# Altium schematic sheet Sheet1.SchDoc (part 3 of 4)
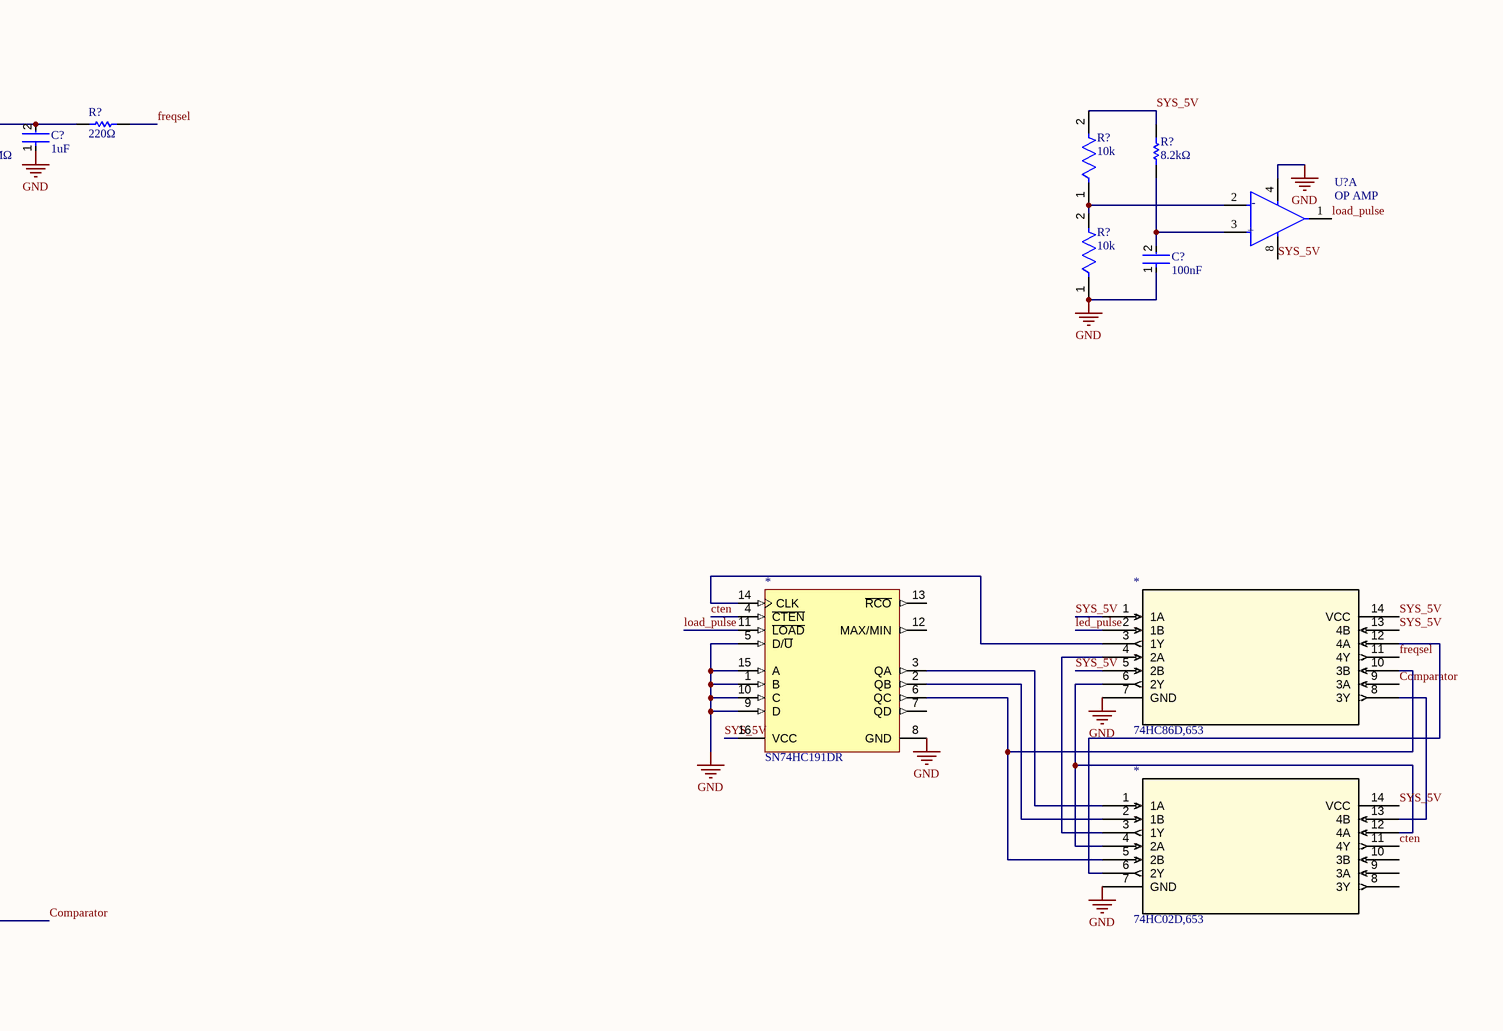
[diagram p3: Sheet1.SchDoc, right]

## Library data of the parts (continued)
C?#10 = CC0805CRNPO9BN5R0: CAP CER 5pF 50V NP0 0805; Manufacturer: Yageo Group; Dielectric: C0G; Dielectric Material: Ceramic; Supplier: Future Electronics; Supplier Part Number: CC0805CRNPO9BN5R0; Manufacturer Part Number: CC0805CRNPO9BN5R0; RoHS: Compliant; Category: Ceramic Capacitors; Stock: 16000; Pricing: 4000=0.0639, 8000=0.0628, 12000=0.0622, 16000=0.0617, 20000=0.0604 (USD); Value: 5pF; Case/Package: 0805; Case Code (Imperial): 0805; Case Code (Metric): 2012; China RoHS: Compliant; Composition: Ceramic; Depth: 1.25mm; Halogen Free: Halogen Free; Lead Free: Lead Free; Length: 2mm; Lifecycle Status: Production; Max Operating Temperature: 125°C; Min Operating Temperature: -55°C; Mounting Technology: Surface Mount; Number of Terminals: 2; Packaging: Tape and Reel; Radiation Hardening: No; REACH SVHC: Unaffected; Termination: SMD/SMT; Thickness: 711.2µm; Voltage Rating: 50V; Voltage Rating (DC): 50V; Weight: 5.499807mg; Width: 1.2446mm; ComponentLink1URL: https://datasheet.octopart.com:443/CC0805CRNPO9BN5R0-Yageo-datasheet-137875056.pdf?src-supplier=IHS; ComponentLink1Description: https://datasheet.octopart.com:443/CC0805CRNPO9BN5R0-Yageo-datasheet-137875056.pdf?src-supplier=IHS; ComponentLink2URL: https://datasheet.octopart.com:443/CC0805CRNPO9BN5R0-Yageo-Group-datasheet-192360829.pdf?src-supplier=Future+Electronics; ComponentLink2Description: https://datasheet.octopart.com:443/CC0805CRNPO9BN5R0-Yageo-Group-datasheet-192360829.pdf?src-supplier=Future+Electronics; ComponentLink3URL: https://datasheet.octopart.com:443/CC0805CRNPO9BN5R0-Yageo-datasheet-137700082.pdf?src-supplier=Future+Electronics; ComponentLink3Description: https://datasheet.octopart.com:443/CC0805CRNPO9BN5R0-Yageo-datasheet-137700082.pdf?src-supplier=Future+Electronics; ComponentLink4URL: https://datasheet.octopart.com:443/CC0805CRNPO9BN5R0-Yageo-datasheet-78855684.pdf?src-supplier=Future+Electronics; ComponentLink4Description: https://datasheet.octopart.com:443/CC0805CRNPO9BN5R0-Yageo-datasheet-78855684.pdf?src-supplier=Future+Electronics; ComponentLink5URL: https://datasheet.octopart.com:443/CC0805CRNPO9BN5R0-Yageo-datasheet-24578986.pdf?src-supplier=Future+Electronics; ComponentLink5Description: https://datasheet.octopart.com:443/CC0805CRNPO9BN5R0-Yageo-datasheet-24578986.pdf?src-supplier=Future+Electronics; ComponentLink6URL: https://datasheet.octopart.com:443/CC0805CRNPO9BN5R0-Yageo-datasheet-16730043.pdf?src-supplier=Future+Electronics; ComponentLink6Description: https://datasheet.octopart.com:443/CC0805CRNPO9BN5R0-Yageo-datasheet-16730043.pdf?src-supplier=Future+Electronics; ComponentLink7URL: https://datasheet.octopart.com:443/CC0805CRNPO9BN5R0-Yageo-datasheet-12589826.pdf?src-supplier=Future+Electronics; ComponentLink7Description: https://datasheet.octopart.com:443/CC0805CRNPO9BN5R0-Yageo-datasheet-12589826.pdf?src-supplier=Future+Electronics; ComponentLink8URL: https://datasheet.octopart.com:443/CC0805CRNPO9BN5R0-Yageo-datasheet-182878260.pdf?src-supplier=Farnell; ComponentLink8Description: https://datasheet.octopart.com:443/CC0805CRNPO9BN5R0-Yageo-datasheet-182878260.pdf?src-supplier=Farnell; ComponentLink9URL: https://datasheet.octopart.com:443/CC0805CRNPO9BN5R0-Yageo-datasheet-151948684.pdf?src-supplier=Newark; ComponentLink9Description: https://datasheet.octopart.com:443/CC0805CRNPO9BN5R0-Yageo-datasheet-151948684.pdf?src-supplier=Newark; ComponentLink10URL: https://datasheet.octopart.com:443/CC0805CRNPO9BN5R0-Yageo-datasheet-10406438.pdf?src-supplier=_legacy+Avnet; ComponentLink10Description: https://datasheet.octopart.com:443/CC0805CRNPO9BN5R0-Yageo-datasheet-10406438.pdf?src-supplier=_legacy+Avnet; ComponentLink11URL: http://sigma.octopart.com:80/conflict_mineral_statement/Yageo-company-3.pdf?src-supplier=Compliance+Statements; ComponentLink11Description: http://sigma.octopart.com:80/conflict_mineral_statement/Yageo-company-3.pdf?src-supplier=Compliance+Statements; ComponentLink12URL: http://sigma.octopart.com:80/rohs_statement/Yageo-company-2.pdf?src-supplier=Compliance+Statements; ComponentLink12Description: http://sigma.octopart.com:80/rohs_statement/Yageo-company-2.pdf?src-supplier=Compliance+Statements
C?#14 = CL21B102KBCNNNC: CAP CER 1nF 50V X7R 0805; Manufacturer: Samsung Electro-Mechanics; Dielectric Material: Ceramic; Tolerance: 10%; Supplier: Avnet; Supplier Part Number: CL21B102KBCNNNC; Manufacturer Part Number: CL21B102KBCNNNC; RoHS: Compliant; Category: Ceramic Capacitors; Stock: 428000; Pricing: 4000=0.0102 (USD); Value: 1nF; Case/Package: 0805; Case Code (Imperial): 0805; Case Code (Metric): 2012; China RoHS: Compliant; Country of Origin: Mainland China, Philippines, South Korea; Depth: 1.25mm; Dielectric: X7R; Export Control Classification Number (ECCN) Code: EAR99; Height: 850µm; Harmonized Tariff Schedule (HTS) Code: 8532.24.00.20; Introduction Date: 2010-07-30; Lead Free: Lead Free; Length: 2mm; Lifecycle Status: Production; Material: Ceramic; Max Operating Temperature: 125°C; Min Operating Temperature: -55°C; Mounting Technology: Surface Mount; Number of Terminals: 2; Radiation Hardening: No; REACH SVHC: Unaffected; Schedule B: 8532240020, 8532240020|8532240020|8532240020|8532240020|8532240020|8532240020|8532240020|8532240020|8532240020|8532240020|8532240020|8532240020|8532240020|8532240020|8532240020|8532240020|8532240020|8532240020|8532240020|8532240020|8532240020|8532240020|8532240020|85; Thickness: 939.8µm; Voltage Rating: 50V; Voltage Rating (DC): 50V; Width: 1.25mm; ComponentLink1URL: https://datasheet.octopart.com:443/CL21B102KBCNNNC-Samsung-Electro-Mechanics-datasheet-136482475.pdf?src-supplier=IHS; ComponentLink1Description: https://datasheet.octopart.com:443/CL21B102KBCNNNC-Samsung-Electro-Mechanics-datasheet-136482475.pdf?src-supplier=IHS; ComponentLink2URL: https://datasheet.octopart.com:443/CL21B102KBCNNNC-Samsung-Electro-Mechanics-datasheet-116891019.pdf?src-supplier=Future+Electronics; ComponentLink2Description: https://datasheet.octopart.com:443/CL21B102KBCNNNC-Samsung-Electro-Mechanics-datasheet-116891019.pdf?src-supplier=Future+Electronics; ComponentLink3URL: https://datasheet.octopart.com:443/CL21B102KBCNNNC-Samsung-Electro-Mechanics-datasheet-81462161.pdf?src-supplier=Future+Electronics; ComponentLink3Description: https://datasheet.octopart.com:443/CL21B102KBCNNNC-Samsung-Electro-Mechanics-datasheet-81462161.pdf?src-supplier=Future+Electronics; ComponentLink4URL: https://datasheet.octopart.com:443/CL21B102KBCNNNC-Samsung-datasheet-31820677.pdf?src-supplier=Future+Electronics; ComponentLink4Description: https://datasheet.octopart.com:443/CL21B102KBCNNNC-Samsung-datasheet-31820677.pdf?src-supplier=Future+Electronics; ComponentLink5URL: https://datasheet.octopart.com:443/CL21B102KBCNNNC-Samsung-Electro-Mechanics-datasheet-149045903.pdf?src-supplier=Future+Electronics; ComponentLink5Description: https://datasheet.octopart.com:443/CL21B102KBCNNNC-Samsung-Electro-Mechanics-datasheet-149045903.pdf?src-supplier=Future+Electronics; ComponentLink6URL: https://datasheet.octopart.com:443/CL21B102KBCNNNC-Samsung-datasheet-37081328.pdf?src-supplier=Future+Electronics; ComponentLink6Description: https://datasheet.octopart.com:443/CL21B102KBCNNNC-Samsung-datasheet-37081328.pdf?src-supplier=Future+Electronics; ComponentLink7URL: https://datasheet.octopart.com/CL21B102KBCNNNC-Samsung-Electro-Mechanics-datasheet-97040617.pdf; ComponentLink7Description: https://datasheet.octopart.com/CL21B102KBCNNNC-Samsung-Electro-Mechanics-datasheet-97040617.pdf; ComponentLink8URL: https://datasheet.octopart.com/CL21B102KBCNNNC-Samsung-Electro-Mechanics-datasheet-8324245.pdf; ComponentLink8Description: https://datasheet.octopart.com/CL21B102KBCNNNC-Samsung-Electro-Mechanics-datasheet-8324245.pdf; ComponentLink9URL: https://datasheet.octopart.com/General-Multilayer-Ceramic-Capacitors-Samsung-datasheet-family-111.pdf; ComponentLink9Description: https://datasheet.octopart.com/General-Multilayer-Ceramic-Capacitors-Samsung-datasheet-family-111.pdf; ComponentLink10URL: http://sigma.octopart.com:80/rohs_certificate/General-Multilayer-Ceramic-Capacitors-Samsung-family-110.pdf?src-supplier=Compliance+Statements; ComponentLink10Description: http://sigma.octopart.com:80/rohs_certificate/General-Multilayer-Ceramic-Capacitors-Samsung-family-110.pdf?src-supplier=Compliance+Statements; ComponentLink11URL: http://sigma.octopart.com:80/rohs_statement/General-Multilayer-Ceramic-Capacitors-Samsung-family-132.pdf?src-supplier=Compliance+Statements; ComponentLink11Description: http://sigma.octopart.com:80/rohs_statement/General-Multilayer-Ceramic-Capacitors-Samsung-family-132.pdf?src-supplier=Compliance+Statements; ComponentLink12URL: http://sigma.octopart.com:80/reach_statement/General-Multilayer-Ceramic-Capacitors-Samsung-family-133.pdf?src-supplier=Compliance+Statements; ComponentLink12Description: http://sigma.octopart.com:80/reach_statement/General-Multilayer-Ceramic-Capacitors-Samsung-family-133.pdf?src-supplier=Compliance+Statements
C?#15 = CC0805JRNPO9BN100: CAP CER 10pF 50V NP0 0805; Manufacturer: Yageo Group; Manufacturer Package Identifier: 0805 (2012 metric); Dielectric: C0G; Dielectric Material: Ceramic; Temperature Coefficient: 30ppm/°C; Tolerance: 5%; Supplier: Future Electronics; Supplier Part Number: CC0805JRNPO9BN100; Manufacturer Part Number: CC0805JRNPO9BN100; RoHS: Compliant; Category: Ceramic Capacitors; Stock: 244000; Pricing: 4000=0.0962, 8000=0.0945, 12000=0.0936, 16000=0.0929, 20000=0.0908 (USD); Value: 10pF; Case/Package: 0805; Case Code (Imperial): 0805; Case Code (Metric): 2012; China RoHS: Compliant; Composition: Ceramic; Country of Origin: Mainland China, Taiwan; Depth: 1.25mm; Export Control Classification Number (ECCN) Code: EAR99; Halogen Free: Halogen Free; Height: 600µm; Harmonized Tariff Schedule (HTS) Code: 8532.24.00.20; Introduction Date: 2005-07-07; Lead Free: Lead Free; Length: 2mm; Lifecycle Status: Production; Material: Ceramic; Max Operating Temperature: 125°C; Min Operating Temperature: -55°C; Mounting Technology: Surface Mount; Pins: 2; Number of Terminals: 2; Packaging: Digi-Reel®; Radiation Hardening: No; REACH SVHC: Unaffected; Schedule B: 8532240020, 8532240020|8532240020, 8532240020|8532240020|8532240020, 8532240020|8532240020|8532240020|8532240020; Termination: SMD/SMT; Thickness: 609.6µm; Voltage Rating: 50V; Voltage Rating (DC): 50V; Width: 1.25mm; ComponentLink1URL: https://datasheet.octopart.com:443/CC0805JRNPO9BN100-Yageo-datasheet-182140217.pdf?src-supplier=IHS; ComponentLink1Description: https://datasheet.octopart.com:443/CC0805JRNPO9BN100-Yageo-datasheet-182140217.pdf?src-supplier=IHS; ComponentLink2URL: https://datasheet.octopart.com:443/CC0805JRNPO9BN100-Yageo-datasheet-151948684.pdf?src-supplier=Farnell; ComponentLink2Description: https://datasheet.octopart.com:443/CC0805JRNPO9BN100-Yageo-datasheet-151948684.pdf?src-supplier=Farnell; ComponentLink3URL: https://datasheet.octopart.com:443/CC0805JRNPO9BN100-Yageo-datasheet-137875056.pdf?src-supplier=Future+Electronics; ComponentLink3Description: https://datasheet.octopart.com:443/CC0805JRNPO9BN100-Yageo-datasheet-137875056.pdf?src-supplier=Future+Electronics; ComponentLink4URL: https://datasheet.octopart.com:443/CC0805JRNPO9BN100-Yageo-datasheet-136957424.pdf?src-supplier=Future+Electronics; ComponentLink4Description: https://datasheet.octopart.com:443/CC0805JRNPO9BN100-Yageo-datasheet-136957424.pdf?src-supplier=Future+Electronics; ComponentLink5URL: https://datasheet.octopart.com:443/CC0805JRNPO9BN100-Yageo-datasheet-137700082.pdf?src-supplier=Future+Electronics; ComponentLink5Description: https://datasheet.octopart.com:443/CC0805JRNPO9BN100-Yageo-datasheet-137700082.pdf?src-supplier=Future+Electronics; ComponentLink6URL: https://datasheet.octopart.com:443/CC0805JRNPO9BN100-Yageo-datasheet-78855684.pdf?src-supplier=Future+Electronics; ComponentLink6Description: https://datasheet.octopart.com:443/CC0805JRNPO9BN100-Yageo-datasheet-78855684.pdf?src-supplier=Future+Electronics; ComponentLink7URL: https://datasheet.octopart.com:443/CC0805JRNPO9BN100-Yageo-datasheet-16730043.pdf?src-supplier=Future+Electronics; ComponentLink7Description: https://datasheet.octopart.com:443/CC0805JRNPO9BN100-Yageo-datasheet-16730043.pdf?src-supplier=Future+Electronics; ComponentLink8URL: https://datasheet.octopart.com:443/CC0805JRNPO9BN100-Yageo-datasheet-12589826.pdf?src-supplier=Future+Electronics; ComponentLink8Description: https://datasheet.octopart.com:443/CC0805JRNPO9BN100-Yageo-datasheet-12589826.pdf?src-supplier=Future+Electronics; ComponentLink9URL: https://datasheet.octopart.com:443/CC0805JRNPO9BN100-Yageo-datasheet-8817079.pdf?src-supplier=Future+Electronics; ComponentLink9Description: https://datasheet.octopart.com:443/CC0805JRNPO9BN100-Yageo-datasheet-8817079.pdf?src-supplier=Future+Electronics; ComponentLink10URL: https://datasheet.octopart.com:443/CC0805JRNPO9BN100-Yageo-datasheet-8324240.pdf?src-supplier=Future+Electronics; ComponentLink10Description: https://datasheet.octopart.com:443/CC0805JRNPO9BN100-Yageo-datasheet-8324240.pdf?src-supplier=Future+Electronics; ComponentLink11URL: https://datasheet.octopart.com:443/CC0805JRNPO9BN100-Yageo-datasheet-504625.pdf?src-supplier=Future+Electronics; ComponentLink11Description: https://datasheet.octopart.com:443/CC0805JRNPO9BN100-Yageo-datasheet-504625.pdf?src-supplier=Future+Electronics; ComponentLink12URL: https://datasheet.octopart.com:443/CC0805JRNPO9BN100-Yageo-datasheet-5321569.pdf?src-supplier=Future+Electronics; ComponentLink12Description: https://datasheet.octopart.com:443/CC0805JRNPO9BN100-Yageo-datasheet-5321569.pdf?src-supplier=Future+Electronics; ComponentLink13URL: https://datasheet.octopart.com:443/CC0805JRNPO9BN100-Yageo-datasheet-181969245.pdf?src-supplier=Newark; ComponentLink13Description: https://datasheet.octopart.com:443/CC0805JRNPO9BN100-Yageo-datasheet-181969245.pdf?src-supplier=Newark; ComponentLink14URL: https://datasheet.octopart.com:443/CC0805JRNPO9BN100-Yageo-datasheet-10406438.pdf?src-supplier=Newark; ComponentLink14Description: https://datasheet.octopart.com:443/CC0805JRNPO9BN100-Yageo-datasheet-10406438.pdf?src-supplier=Newark; ComponentLink15URL: https://datasheet.octopart.com:443/CC0805JRNPO9BN100-Yageo-datasheet-65873193.pdf?src-supplier=Newark; ComponentLink15Description: https://datasheet.octopart.com:443/CC0805JRNPO9BN100-Yageo-datasheet-65873193.pdf?src-supplier=Newark; ComponentLink16URL: https://datasheet.octopart.com:443/CC0805JRNPO9BN100-Yageo-Group-datasheet-188129580.pdf?src-supplier=LCSC; ComponentLink16Description: https://datasheet.octopart.com:443/CC0805JRNPO9BN100-Yageo-Group-datasheet-188129580.pdf?src-supplier=LCSC; ComponentLink17URL: https://datasheet.octopart.com:443/CC0805JRNPO9BN100-Yageo-datasheet-24578986.pdf?src-supplier=iodParts+Technologies+Inc.; ComponentLink17Description: https://datasheet.octopart.com:443/CC0805JRNPO9BN100-Yageo-datasheet-24578986.pdf?src-supplier=iodParts+Technologies+Inc.; ComponentLink18URL: https://datasheet.octopart.com:443/CC0805JRNPO9BN100-Yageo-datasheet-8555986.pdf?src-supplier=TME; ComponentLink18Description: https://datasheet.octopart.com:443/CC0805JRNPO9BN100-Yageo-datasheet-8555986.pdf?src-supplier=TME; ComponentLink19URL: http://sigma.octopart.com:80/conflict_mineral_statement/Yageo-company-3.pdf?src-supplier=Compliance+Statements; ComponentLink19Description: http://sigma.octopart.com:80/conflict_mineral_statement/Yageo-company-3.pdf?src-supplier=Compliance+Statements; ComponentLink20URL: http://sigma.octopart.com:80/rohs_statement/Yageo-company-2.pdf?src-supplier=Compliance+Statements; ComponentLink20Description: http://sigma.octopart.com:80/rohs_statement/Yageo-company-2.pdf?src-supplier=Compliance+Statements
D?#1-D?#4 = 1N4148WS: Diode Ultra Fast Recovery Rectifier 75V 0.15A 2-Pin SOD-323F T/R; Manufacturer: onsemi; Manufacturer Lifecycle Status: ACTIVE; Average Rectified Current: 150mA; Value: 4pF; Element Configuration: Single; Forward Voltage: 1V; Max Forward Surge Current (Ifsm): 4A; Max Junction Temperature (Tj): 150°C; Max Power Dissipation: 200mW; Number of Elements: 1; Peak Reverse Current: 5µA; Recovery Time: 4ns; Supplier: Future Electronics; Supplier Part Number: 1N4148WS; Manufacturer Part Number: 1N4148WS; RoHS: Compliant; Category: Rectifier Diodes; Stock: 2079000; Pricing: 3000=0.0259, 9000=0.0253, 30000=0.0247, 60000=0.0243, 120000=0.0236 (USD); China RoHS: Compliant; Contact Plating: Tin; Export Control Classification Number (ECCN) Code: EAR99; Forward Current: 150mA; Height: 900µm; Harmonized Tariff Schedule (HTS) Code: 8541.10.00.70; Introduction Date: 2008-03-28; Lead Free: Lead Free; Length: 1.8mm; Lifecycle Status: Production; Max Operating Temperature: 150°C; Max Output current: 150mA; Max Repetitive Reverse Voltage (Vrrm): 75V; Max Reverse Voltage (DC): 75V; Min Breakdown Voltage: 75V; Min Operating Temperature: -55°C; Mounting Technology: Surface Mount; Pins: 2; Number of Terminals: 2; Packaging: Cut Tape; Power Dissipation: 200mW; Radiation Hardening: No; REACH SVHC: Unaffected; Reverse Recovery Time: 4ns; Reverse Standoff Voltage: 75V; Reverse Voltage: 75V; Schedule B: 8541100070, 8541100070|8541100070|8541100070|8541100070|8541100070|8541100070|8541100070|8541100070|8541100070|8541100070|8541100070|8541100070|8541100070|8541100070|8541100070|8541100070|8541100070|8541100070|8541100070|8541100070|8541100070|8541100070|8541100070|85; Weight: 27.6mg; Width: 1.35mm; ComponentLink1URL: https://datasheet.octopart.com:443/1N4148WS-ON-Semiconductor-datasheet-154551630.pdf?src-supplier=Farnell; ComponentLink1Description: https://datasheet.octopart.com:443/1N4148WS-ON-Semiconductor-datasheet-154551630.pdf?src-supplier=Farnell; ComponentLink2URL: https://datasheet.octopart.com:443/1N4148WS-Fairchild-Semiconductor-datasheet-67878664.pdf?src-supplier=Farnell; ComponentLink2Description: https://datasheet.octopart.com:443/1N4148WS-Fairchild-Semiconductor-datasheet-67878664.pdf?src-supplier=Farnell; ComponentLink3URL: https://datasheet.octopart.com:443/1N4148WS-Fairchild-Semiconductor-datasheet-68650011.pdf?src-supplier=Farnell; ComponentLink3Description: https://datasheet.octopart.com:443/1N4148WS-Fairchild-Semiconductor-datasheet-68650011.pdf?src-supplier=Farnell; ComponentLink4URL: https://datasheet.octopart.com:443/1N4148WS-ON-Semiconductor-datasheet-11741836.pdf?src-supplier=Upverter; ComponentLink4Description: https://datasheet.octopart.com:443/1N4148WS-ON-Semiconductor-datasheet-11741836.pdf?src-supplier=Upverter; ComponentLink5URL: https://datasheet.octopart.com:443/1N4148WS-ON-Semiconductor-datasheet-137236190.pdf?src-supplier=Upverter; ComponentLink5Description: https://datasheet.octopart.com:443/1N4148WS-ON-Semiconductor-datasheet-137236190.pdf?src-supplier=Upverter; ComponentLink6URL: https://sigma.octopart.com:443/138895951/technical_drawing/ON-Semiconductor-1N4148WS.pdf?src-supplier=Upverter; ComponentLink6Description: https://sigma.octopart.com:443/138895951/technical_drawing/ON-Semiconductor-1N4148WS.pdf?src-supplier=Upverter; ComponentLink7URL: https://datasheet.octopart.com:443/1N4148WS-ON-Semiconductor-datasheet-41168538.pdf?src-supplier=IHS; ComponentLink7Description: https://datasheet.octopart.com:443/1N4148WS-ON-Semiconductor-datasheet-41168538.pdf?src-supplier=IHS; ComponentLink8URL: https://datasheet.octopart.com:443/1N4148WS-onsemi-datasheet-175423434.pdf?src-supplier=IHS; ComponentLink8Description: https://datasheet.octopart.com:443/1N4148WS-onsemi-datasheet-175423434.pdf?src-supplier=IHS; ComponentLink9URL: https://datasheet.octopart.com:443/1N4148WS-onsemi-datasheet-181265883.pdf?src-supplier=IHS; ComponentLink9Description: https://datasheet.octopart.com:443/1N4148WS-onsemi-datasheet-181265883.pdf?src-supplier=IHS; ComponentLink10URL: https://datasheet.octopart.com:443/1N4148WS-ON-Semiconductor-datasheet-85393213.pdf?src-supplier=onsemi; ComponentLink10Description: https://datasheet.octopart.com:443/1N4148WS-ON-Semiconductor-datasheet-85393213.pdf?src-supplier=onsemi; ComponentLink11URL: https://datasheet.octopart.com:443/1N4148WS-ON-Semiconductor-datasheet-86684483.pdf?src-supplier=onsemi; ComponentLink11Description: https://datasheet.octopart.com:443/1N4148WS-ON-Semiconductor-datasheet-86684483.pdf?src-supplier=onsemi; ComponentLink12URL: https://datasheet.octopart.com:443/1N4148WS-ON-Semiconductor-datasheet-86681927.pdf?src-supplier=element14+APAC; ComponentLink12Description: https://datasheet.octopart.com:443/1N4148WS-ON-Semiconductor-datasheet-86681927.pdf?src-supplier=element14+APAC; ComponentLink13URL: https://datasheet.octopart.com:443/1N4148WS-Fairchild-datasheet-514620.pdf?src-supplier=Fairchild+Semiconductor; ComponentLink13Description: https://datasheet.octopart.com:443/1N4148WS-Fairchild-datasheet-514620.pdf?src-supplier=Fairchild+Semiconductor; ComponentLink14URL: https://sigma.octopart.com:443/17343424/technical_drawing/Fairchild-Semiconductor-1N4148WS.pdf?src-supplier=Fairchild+Semiconductor; ComponentLink14Description: https://sigma.octopart.com:443/17343424/technical_drawing/Fairchild-Semiconductor-1N4148WS.pdf?src-supplier=Fairchild+Semiconductor; ComponentLink15URL: https://datasheet.octopart.com:443/1N4148WS-Fairchild-Semiconductor-datasheet-14041777.pdf?src-supplier=iiiC; ComponentLink15Description: https://datasheet.octopart.com:443/1N4148WS-Fairchild-Semiconductor-datasheet-14041777.pdf?src-supplier=iiiC; ComponentLink16URL: https://datasheet.octopart.com:443/1N4148WS-Fairchild-Semiconductor-datasheet-67909704.pdf?src-supplier=Newark; ComponentLink16Description: https://datasheet.octopart.com:443/1N4148WS-Fairchild-Semiconductor-datasheet-67909704.pdf?src-supplier=Newark; ComponentLink17URL: https://datasheet.octopart.com:443/1N4148WS-Fairchild-Semiconductor-datasheet-68364970.pdf?src-supplier=Newark; ComponentLink17Description: https://datasheet.octopart.com:443/1N4148WS-Fairchild-Semiconductor-datasheet-68364970.pdf?src-supplier=Newark; ComponentLink18URL: http://sigma.octopart.com:80/150599222/rohs_statement/ON-Semiconductor-1N4148WS.pdf?src-supplier=Compliance+Statements; ComponentLink18Description: http://sigma.octopart.com:80/150599222/rohs_statement/ON-Semiconductor-1N4148WS.pdf?src-supplier=Compliance+Statements; ComponentLink19URL: http://sigma.octopart.com:80/17343422/reach_statement/Fairchild-Semiconductor-1N4148WS.pdf?src-supplier=Compliance+Statements; ComponentLink19Description: http://sigma.octopart.com:80/17343422/reach_statement/Fairchild-Semiconductor-1N4148WS.pdf?src-supplier=Compliance+Statements; ComponentLink20URL: http://sigma.octopart.com:80/17343423/materials_sheet/Fairchild-Semiconductor-1N4148WS.pdf?src-supplier=Compliance+Statements; ComponentLink20Description: http://sigma.octopart.com:80/17343423/materials_sheet/Fairchild-Semiconductor-1N4148WS.pdf?src-supplier=Compliance+Statements; ComponentLink21URL: http://sigma.octopart.com:80/33026183/reach_statement/Fairchild-Semiconductor-1N4148WS.pdf?src-supplier=Compliance+Statements; ComponentLink21Description: http://sigma.octopart.com:80/33026183/reach_statement/Fairchild-Semiconductor-1N4148WS.pdf?src-supplier=Compliance+Statements; ComponentLink22URL: http://sigma.octopart.com:80/33026185/materials_sheet/Fairchild-Semiconductor-1N4148WS.pdf?src-supplier=Compliance+Statements; ComponentLink22Description: http://sigma.octopart.com:80/33026185/materials_sheet/Fairchild-Semiconductor-1N4148WS.pdf?src-supplier=Compliance+Statements; ComponentLink23URL: http://sigma.octopart.com:80/reach_statement/ON-Semiconductor-company-79.pdf?src-supplier=Compliance+Statements; ComponentLink23Description: http://sigma.octopart.com:80/reach_statement/ON-Semiconductor-company-79.pdf?src-supplier=Compliance+Statements; ComponentLink24URL: http://sigma.octopart.com:80/rohs_statement/Fairchild-Semiconductor-company-11.pdf?src-supplier=Compliance+Statements; ComponentLink24Description: http://sigma.octopart.com:80/rohs_statement/Fairchild-Semiconductor-company-11.pdf?src-supplier=Compliance+Statements; ComponentLink25URL: http://sigma.octopart.com:80/rohs_statement/Fairchild-Semiconductor-company-10.pdf?src-supplier=Compliance+Statements; ComponentLink25Description: http://sigma.octopart.com:80/rohs_statement/Fairchild-Semiconductor-company-10.pdf?src-supplier=Compliance+Statements; ComponentLink26URL: http://sigma.octopart.com:80/reach_statement/Fairchild-Semiconductor-company-9.pdf?src-supplier=Compliance+Statements; ComponentLink26Description: http://sigma.octopart.com:80/reach_statement/Fairchild-Semiconductor-company-9.pdf?src-supplier=Compliance+Statements; ComponentLink27URL: https://octopart.com:443/opatz8j6/c1?t=wYHt1dYoStjiSyYS9vW1pk8TBFbYWJPKFwAairMtkTI2IzetMnotf66dDCFSyjK73l_QBYJfu5ppQQm6vgf_VHJk0XjigTM6-T2M3bc91CoF2qDUavTaGra1FaS73nSZTMHoTBKea7Kj1j1hvcXpUjB2Zk0lMEeZ2KChoJjU2Ep7qPghMWyiv02ETchNH2mt-frVeZibxDJuov5OgRy4oXlMX2fxSj9TvPDNPennBmBqeUUTYkCA50MC-HqnwAKd1gKHUqYazBTe_nq1LN0s0W5Jcc0mVIJ85rMEaCpPi0OTe20L35dkFVsyd7-f2a8RbDuWQx2ZnqCVBv226imj86RP5GabsSkQ-q8&src-supplier=Compliance+Statements; ComponentLink27Description: https://octopart.com:443/opatz8j6/c1?t=wYHt1dYoStjiSyYS9vW1pk8TBFbYWJPKFwAairMtkTI2IzetMnotf66dDCFSyjK73l_QBYJfu5ppQQm6vgf_VHJk0XjigTM6-T2M3bc91CoF2qDUavTaGra1FaS73nSZTMHoTBKea7Kj1j1hvcXpUjB2Zk0lMEeZ2KChoJjU2Ep7qPghMWyiv02ETchNH2mt-frVeZibxDJuov5OgRy4oXlMX2fxSj9TvPDNPennBmBqeUUTYkCA50MC-HqnwAKd1gKHUqYazBTe_nq1LN0s0W5Jcc0mVIJ85rMEaCpPi0OTe20L35dkFVsyd7-f2a8RbDuWQx2ZnqCVBv226imj86RP5GabsSkQ-q8&src-supplier=Compliance+Statements; ComponentLink28URL: https://octopart.com:443/opatz8j6/c1?t=6vrIx-b4A-5fTDbLjwi5zcgi6qXstL13SMOS8GjYhuBtwDmRjNAy9ckQ1j_vzrk3p8PqJRRo0Q4ZFDRtNoBSdN2VF6uD6HFnto0wbTQpFwKFVCYeCRTsvot6NzZ0_E0kU2SFINObuRWijlVlxtaCxHPxDSHGUbvJMCGqPlgW3d4BMWXN1gHWf3JhMnqeX7DV1-lrPzrjwC1tz_ReOkIeYv0g5upleZgG8h_6jp4K0TmHBgFsbpIaQ-XR6Em3Oa61Yv4vos_yXn82U0YoobWb_whq6HKgdR1UB_qD5SusD-cTSj2uztk2uKh_PoqkpyxAx9Tc5grDAFkfViYluG8WwhfepkjrF-7yDpGH&src-supplier=Compliance+Statements; ComponentLink28Description: https://octopart.com:443/opatz8j6/c1?t=6vrIx-b4A-5fTDbLjwi5zcgi6qXstL13SMOS8GjYhuBtwDmRjNAy9ckQ1j_vzrk3p8PqJRRo0Q4ZFDRtNoBSdN2VF6uD6HFnto0wbTQpFwKFVCYeCRTsvot6NzZ0_E0kU2SFINObuRWijlVlxtaCxHPxDSHGUbvJMCGqPlgW3d4BMWXN1gHWf3JhMnqeX7DV1-lrPzrjwC1tz_ReOkIeYv0g5upleZgG8h_6jp4K0TmHBgFsbpIaQ-XR6Em3Oa61Yv4vos_yXn82U0YoobWb_whq6HKgdR1UB_qD5SusD-cTSj2uztk2uKh_PoqkpyxAx9Tc5grDAFkfViYluG8WwhfepkjrF-7yDpGH&src-supplier=Compliance+Statements
Q? = IRF4905STRLPBF: MOSFET P-CH 55V 42A D2PAK; Manufacturer: Infineon; Drain to Source Breakdown Voltage: -55V; Drain to Source Resistance: 20mΩ; Element Configuration: Single; Fall Time: 64ns; Gate to Source Voltage (Vgs): 20V; Input Capacitance: 3.5nF; Max Junction Temperature (Tj): 150°C; Max Power Dissipation: 170W; Nominal Vgs: 4V; Number of Channels: 1; Power Dissipation: 150W; Value: 20mΩ; Rise Time: 99ns; Turn-Off Delay Time: 51ns; Turn-On Delay Time: 20ns; Supplier: Future Electronics; Supplier Part Number: IRF4905STRLPBF; Manufacturer Part Number: IRF4905STRLPBF; RoHS: Compliant; Category: MOSFETs; Stock: 20800; Pricing: 800=2.4 (USD); Case/Package: D2PAK; China RoHS: Non-Compliant; Continuous Drain Current (ID): 42A; Country of Origin: Mainland China; Drain to Source Voltage (Vdss): -55V; Dual Supply Voltage: 55V; Export Control Classification Number (ECCN) Code: EAR99; Height: 5.084mm; Harmonized Tariff Schedule (HTS) Code: 8541.29.00.95; Introduction Date: 1996-07-26; Lead Free: Lead Free; Length: 10.67mm; Lifecycle Status: Production; Max Operating Temperature: 150°C; Min Breakdown Voltage: 55V; Min Operating Temperature: -55°C; Mounting Technology: Surface Mount; Number of Elements: 1; Pins: 3; Number of Terminals: 2; On-State Resistance: 20mΩ; Package Quantity: 800; Packaging: Cut Tape; Radiation Hardening: No; Rds On Max: 20mΩ; REACH SVHC: Affected; Schedule B: 8541290080, 8541290080|8541290080|8541290080|8541290080|8541290080|8541290080|8541290080|8541290080|8541290080|8541290080|8541290080|8541290080|8541290080|8541290080|8541290080|8541290080|8541290080|8541290080|8541290080|8541290080|8541290080|8541290080|8541290080|85; Termination: SMD/SMT; Threshold Voltage: 4V; Width: 9.65mm; ComponentLink1URL: https://datasheet.octopart.com:443/IRF4905STRLPBF-Infineon-datasheet-7823242.pdf?src-supplier=element14+APAC; ComponentLink1Description: https://datasheet.octopart.com:443/IRF4905STRLPBF-Infineon-datasheet-7823242.pdf?src-supplier=element14+APAC; ComponentLink2URL: https://datasheet.octopart.com:443/IRF4905STRLPBF-Infineon-datasheet-6397759.pdf?src-supplier=element14+APAC; ComponentLink2Description: https://datasheet.octopart.com:443/IRF4905STRLPBF-Infineon-datasheet-6397759.pdf?src-supplier=element14+APAC; ComponentLink3URL: https://datasheet.octopart.com:443/IRF4905STRLPBF-Infineon-datasheet-180067141.pdf?src-supplier=IHS; ComponentLink3Description: https://datasheet.octopart.com:443/IRF4905STRLPBF-Infineon-datasheet-180067141.pdf?src-supplier=IHS; ComponentLink4URL: https://datasheet.octopart.com:443/IRF4905STRLPBF-Infineon-datasheet-9781395.pdf?src-supplier=RS+(Formerly+Allied+Electronics); ComponentLink4Description: https://datasheet.octopart.com:443/IRF4905STRLPBF-Infineon-datasheet-9781395.pdf?src-supplier=RS+(Formerly+Allied+Electronics); ComponentLink5URL: https://datasheet.octopart.com:443/IRF4905STRLPBF-International-Rectifier-datasheet-8761984.pdf?src-supplier=Jameco+(USA); ComponentLink5Description: https://datasheet.octopart.com:443/IRF4905STRLPBF-International-Rectifier-datasheet-8761984.pdf?src-supplier=Jameco+(USA); ComponentLink6URL: https://datasheet.octopart.com:443/IRF4905STRLPBF-International-Rectifier-datasheet-14060552.pdf?src-supplier=iiiC; ComponentLink6Description: https://datasheet.octopart.com:443/IRF4905STRLPBF-International-Rectifier-datasheet-14060552.pdf?src-supplier=iiiC; ComponentLink7URL: http://sigma.octopart.com:80/conflict_mineral_statement/Infineon-company-51.pdf?src-supplier=Compliance+Statements; ComponentLink7Description: http://sigma.octopart.com:80/conflict_mineral_statement/Infineon-company-51.pdf?src-supplier=Compliance+Statements; ComponentLink8URL: http://sigma.octopart.com:80/reach_statement/International-Rectifier-company-55.pdf?src-supplier=Compliance+Statements; ComponentLink8Description: http://sigma.octopart.com:80/reach_statement/International-Rectifier-company-55.pdf?src-supplier=Compliance+Statements; ComponentLink9URL: http://sigma.octopart.com:80/rohs_statement/International-Rectifier-company-54.pdf?src-supplier=Compliance+Statements; ComponentLink9Description: http://sigma.octopart.com:80/rohs_statement/International-Rectifier-company-54.pdf?src-supplier=Compliance+Statements
R?#1 = FRC0805F2203TS: RES 220kΩ ±1% 125mW 0805
R?#2 R?#5 R?#10 R?#15 R?#17 R?#19 R?#24 = RC0805FR-071ML: RES 1MΩ ±1% 125mW 0805; Manufacturer: Yageo Group; Temperature Coefficient: 100ppm/°C; Voltage Rating: 150V; Supplier: Future Electronics; Supplier Part Number: RC0805FR-071ML; Manufacturer Part Number: RC0805FR-071ML; RoHS: Compliant; Category: Chip SMD Resistors; Stock: 645000; Pricing: 5000=0.0068, 20000=0.0065, 75000=0.0063, 150000=0.0062, 375000=0.006 (USD); Case/Package: 0805; Case Code (Imperial): 0805; China RoHS: Non-Compliant; Composition: Thick Film; Contact Plating: Tin; Country of Origin: Mainland China, Taiwan; Depth: 1.25mm; Export Control Classification Number (ECCN) Code: EAR99; Features: Moisture Resistant; Height: 500µm; Harmonized Tariff Schedule (HTS) Code: 8533.21.00.30; Introduction Date: 2004-09-22; Lead Free: Lead Free; Length: 2mm; Lifecycle Status: Production; Max Operating Temperature: 155°C; Max Power Dissipation: 125mW; Military Standard: Not; Min Operating Temperature: -55°C; Mounting Technology: Surface Mount; Pins: 2; Number of Terminals: 2; Number of Terminations: 2; Packaging: Tape & Reel; Power Rating: 125mW; Radiation Hardening: No; REACH SVHC: Unaffected; Value: 1MΩ; Schedule B: 8533210045, 8533210045|8533210045, 8533210045|8533210045|8533210045, 8533210045|8533210045|8533210045|8533210045; Termination: SMD/SMT; Tolerance: 1%; Voltage Rating (AC): 150V; Voltage Rating (DC): 150V; Width: 1.25mm; Working Voltage: 150V; ComponentLink1URL: https://datasheet.octopart.com:443/RC0805FR-071ML-Yageo-datasheet-175887523.pdf?src-supplier=IHS; ComponentLink1Description: https://datasheet.octopart.com:443/RC0805FR-071ML-Yageo-datasheet-175887523.pdf?src-supplier=IHS; ComponentLink2URL: https://datasheet.octopart.com:443/RC0805FR-071ML-Yageo-datasheet-103092701.pdf?src-supplier=Upverter; ComponentLink2Description: https://datasheet.octopart.com:443/RC0805FR-071ML-Yageo-datasheet-103092701.pdf?src-supplier=Upverter; ComponentLink3URL: https://datasheet.octopart.com:443/RC0805FR-071ML-Yageo-datasheet-79472498.pdf?src-supplier=Upverter; ComponentLink3Description: https://datasheet.octopart.com:443/RC0805FR-071ML-Yageo-datasheet-79472498.pdf?src-supplier=Upverter; ComponentLink4URL: https://datasheet.octopart.com:443/RC0805FR-071ML-Yageo-datasheet-8330313.pdf?src-supplier=element14+APAC; ComponentLink4Description: https://datasheet.octopart.com:443/RC0805FR-071ML-Yageo-datasheet-8330313.pdf?src-supplier=element14+APAC; ComponentLink5URL: https://datasheet.octopart.com:443/RC0805FR-071ML-Yageo-Group-datasheet-190305687.pdf?src-supplier=Future+Electronics; ComponentLink5Description: https://datasheet.octopart.com:443/RC0805FR-071ML-Yageo-Group-datasheet-190305687.pdf?src-supplier=Future+Electronics; ComponentLink6URL: https://datasheet.octopart.com:443/RC0805FR-071ML-Yageo-datasheet-164759695.pdf?src-supplier=Future+Electronics; ComponentLink6Description: https://datasheet.octopart.com:443/RC0805FR-071ML-Yageo-datasheet-164759695.pdf?src-supplier=Future+Electronics; ComponentLink7URL: https://datasheet.octopart.com:443/RC0805FR-071ML-Yageo-datasheet-127823281.pdf?src-supplier=Future+Electronics; ComponentLink7Description: https://datasheet.octopart.com:443/RC0805FR-071ML-Yageo-datasheet-127823281.pdf?src-supplier=Future+Electronics; ComponentLink8URL: https://datasheet.octopart.com:443/RC0805FR-071ML-Yageo-datasheet-137700087.pdf?src-supplier=Future+Electronics; ComponentLink8Description: https://datasheet.octopart.com:443/RC0805FR-071ML-Yageo-datasheet-137700087.pdf?src-supplier=Future+Electronics; ComponentLink9URL: https://datasheet.octopart.com:443/RC0805FR-071ML-Yageo-datasheet-12592811.pdf?src-supplier=Future+Electronics; ComponentLink9Description: https://datasheet.octopart.com:443/RC0805FR-071ML-Yageo-datasheet-12592811.pdf?src-supplier=Future+Electronics; ComponentLink10URL: https://datasheet.octopart.com:443/RC0805FR-071ML-Yageo-datasheet-8324252.pdf?src-supplier=Future+Electronics; ComponentLink10Description: https://datasheet.octopart.com:443/RC0805FR-071ML-Yageo-datasheet-8324252.pdf?src-supplier=Future+Electronics; ComponentLink11URL: https://datasheet.octopart.com:443/RC0805FR-071ML-Yageo-datasheet-62067350.pdf?src-supplier=Farnell; ComponentLink11Description: https://datasheet.octopart.com:443/RC0805FR-071ML-Yageo-datasheet-62067350.pdf?src-supplier=Farnell; ComponentLink12URL: https://datasheet.octopart.com:443/RC0805FR-071ML-Yageo-datasheet-13691069.pdf?src-supplier=Farnell; ComponentLink12Description: https://datasheet.octopart.com:443/RC0805FR-071ML-Yageo-datasheet-13691069.pdf?src-supplier=Farnell; ComponentLink13URL: https://datasheet.octopart.com/RC0805FR-071ML-Yageo-datasheet-73766026.pdf; ComponentLink13Description: https://datasheet.octopart.com/RC0805FR-071ML-Yageo-datasheet-73766026.pdf; ComponentLink14URL: https://datasheet.octopart.com:443/RC0805FR-071ML-Yageo-datasheet-118657.pdf?src-supplier=DigiKey; ComponentLink14Description: https://datasheet.octopart.com:443/RC0805FR-071ML-Yageo-datasheet-118657.pdf?src-supplier=DigiKey; ComponentLink15URL: https://datasheet.octopart.com:443/RC0805FR-071ML-Yageo-datasheet-502840.pdf?src-supplier=element14; ComponentLink15Description: https://datasheet.octopart.com:443/RC0805FR-071ML-Yageo-datasheet-502840.pdf?src-supplier=element14; ComponentLink16URL: http://sigma.octopart.com:80/conflict_mineral_statement/Yageo-company-3.pdf?src-supplier=Compliance+Statements; ComponentLink16Description: http://sigma.octopart.com:80/conflict_mineral_statement/Yageo-company-3.pdf?src-supplier=Compliance+Statements; ComponentLink17URL: http://sigma.octopart.com:80/rohs_statement/Yageo-company-2.pdf?src-supplier=Compliance+Statements; ComponentLink17Description: http://sigma.octopart.com:80/rohs_statement/Yageo-company-2.pdf?src-supplier=Compliance+Statements; LCSC: C107700
R?#3 = 0805W8F2200T5E: RES 220Ω ±1% 125mW 0805; Manufacturer: Royal Ohm; Temperature Coefficient: 100ppm/°C; Working Voltage: 150V; Supplier: Mouser; Supplier Part Number: 303-0805W8F2200T5E; Manufacturer Part Number: 0805W8F2200T5E; RoHS: Compliant; Category: Chip SMD Resistors; Pricing: 10000=0.001 (USD); Case/Package: 0805; China RoHS: Non-Compliant; Lifecycle Status: Production; Max Operating Temperature: 155°C; Min Operating Temperature: -55°C; Mounting Technology: Surface Mount; Number of Terminals: 2; Power Rating: 125mW; REACH SVHC: Unaffected; Value: 220Ω; Tolerance: 1%; ComponentLink1URL: https://datasheet.octopart.com:443/0805W8F2200T5E-Royal-Electronics-datasheet-157855877.pdf?src-supplier=IHS; ComponentLink1Description: https://datasheet.octopart.com:443/0805W8F2200T5E-Royal-Electronics-datasheet-157855877.pdf?src-supplier=IHS; ComponentLink2URL: https://datasheet.octopart.com:443/0805W8F2200T5E-Royal-Ohm-datasheet-165785611.pdf?src-supplier=TME; ComponentLink2Description: https://datasheet.octopart.com:443/0805W8F2200T5E-Royal-Ohm-datasheet-165785611.pdf?src-supplier=TME; ComponentLink3URL: https://datasheet.octopart.com:443/0805W8F2200T5E-Royal-Ohm-datasheet-62069544.pdf?src-supplier=TME; ComponentLink3Description: https://datasheet.octopart.com:443/0805W8F2200T5E-Royal-Ohm-datasheet-62069544.pdf?src-supplier=TME
R?#4 R?#11 R?#12 R?#16 R?#20 = CRCW08051K00FKEA: RES SMD 1K OHM 1% 1/8W 0805; Manufacturer: Vishay Dale; Part Number: CRCW08051K00FKEA
R?#6 = CRCW08058K20FKEA: RES 8.2kΩ ±1% 125mW 0805; Manufacturer: Vishay; Manufacturer Package Identifier: CRCW0805-e3; Temperature Coefficient: 100ppm/°C; Voltage Rating: 150V; Supplier: Future Electronics; Supplier Part Number: CRCW08058K20FKEA; Manufacturer Part Number: CRCW08058K20FKEA; RoHS: Compliant; Category: Chip SMD Resistors; Stock: 90000; Pricing: 5000=0.0094, 20000=0.009, 50000=0.0088, 125000=0.0086, 200000=0.0083 (USD); Case/Package: 0805; Case Code (Imperial): 0805; China RoHS: Non-Compliant; Composition: Thick Film; Contact Plating: Tin; Depth: 1.25mm; Height: 450µm; Lead Free: Lead Free; Length: 2mm; Lifecycle Status: Production; Max Operating Temperature: 155°C; Military Standard: Not; Min Operating Temperature: -55°C; Mounting Technology: Surface Mount; Pins: 2; Number of Terminals: 2; Packaging: Cut Tape; Power Rating: 125mW; Radiation Hardening: No; Ratings: AEC-Q200; REACH SVHC: Unaffected; Value: 8.2kΩ; Schedule B: 8533210045, 8533210045|8533210045, 8533210045|8533210045|8533210045, 8533210045|8533210045|8533210045|8533210045; Termination: SMD/SMT; Tolerance: 1%; Voltage Rating (DC): 150V; Weight: 5.499807mg; Width: 1.25mm; Working Voltage: 150V; ComponentLink1URL: https://datasheet.octopart.com:443/CRCW08058K20FKEA-Vishay-datasheet-175423584.pdf?src-supplier=IHS; ComponentLink1Description: https://datasheet.octopart.com:443/CRCW08058K20FKEA-Vishay-datasheet-175423584.pdf?src-supplier=IHS; ComponentLink2URL: https://datasheet.octopart.com:443/CRCW08058K20FKEA-Vishay-datasheet-83961561.pdf?src-supplier=element14+APAC; ComponentLink2Description: https://datasheet.octopart.com:443/CRCW08058K20FKEA-Vishay-datasheet-83961561.pdf?src-supplier=element14+APAC; ComponentLink3URL: https://datasheet.octopart.com:443/CRCW08058K20FKEA-Vishay-datasheet-62317937.pdf?src-supplier=element14+APAC; ComponentLink3Description: https://datasheet.octopart.com:443/CRCW08058K20FKEA-Vishay-datasheet-62317937.pdf?src-supplier=element14+APAC; ComponentLink4URL: https://datasheet.octopart.com:443/CRCW08058K20FKEA-Vishay-datasheet-14722531.pdf?src-supplier=element14+APAC; ComponentLink4Description: https://datasheet.octopart.com:443/CRCW08058K20FKEA-Vishay-datasheet-14722531.pdf?src-supplier=element14+APAC; ComponentLink5URL: https://datasheet.octopart.com:443/CRCW08058K20FKEA.-Vishay-datasheet-78776209.pdf?src-supplier=element14+APAC; ComponentLink5Description: https://datasheet.octopart.com:443/CRCW08058K20FKEA.-Vishay-datasheet-78776209.pdf?src-supplier=element14+APAC; ComponentLink6URL: https://datasheet.octopart.com:443/CRCW08058K20FKEA-Vishay-datasheet-66077789.pdf?src-supplier=element14+APAC; ComponentLink6Description: https://datasheet.octopart.com:443/CRCW08058K20FKEA-Vishay-datasheet-66077789.pdf?src-supplier=element14+APAC; ComponentLink7URL: https://datasheet.octopart.com:443/CRCW08058K20FKEA-Vishay-datasheet-31669108.pdf?src-supplier=Farnell; ComponentLink7Description: https://datasheet.octopart.com:443/CRCW08058K20FKEA-Vishay-datasheet-31669108.pdf?src-supplier=Farnell; ComponentLink8URL: https://datasheet.octopart.com:443/CRCW08058K20FKEA-Vishay-datasheet-13242068.pdf?src-supplier=Farnell; ComponentLink8Description: https://datasheet.octopart.com:443/CRCW08058K20FKEA-Vishay-datasheet-13242068.pdf?src-supplier=Farnell; ComponentLink9URL: https://datasheet.octopart.com:443/CRCW08058K20FKEA-Vishay-datasheet-13195083.pdf?src-supplier=Farnell; ComponentLink9Description: https://datasheet.octopart.com:443/CRCW08058K20FKEA-Vishay-datasheet-13195083.pdf?src-supplier=Farnell; ComponentLink10URL: https://datasheet.octopart.com:443/CRCW08058K20FKEA-Vishay-datasheet-13034211.pdf?src-supplier=Farnell; ComponentLink10Description: https://datasheet.octopart.com:443/CRCW08058K20FKEA-Vishay-datasheet-13034211.pdf?src-supplier=Farnell; ComponentLink11URL: https://datasheet.octopart.com:443/CRCW08058K20FKEA-Vishay-datasheet-12600034.pdf?src-supplier=Farnell; ComponentLink11Description: https://datasheet.octopart.com:443/CRCW08058K20FKEA-Vishay-datasheet-12600034.pdf?src-supplier=Farnell; ComponentLink12URL: https://datasheet.octopart.com:443/CRCW08058K20FKEA-Vishay-datasheet-12532161.pdf?src-supplier=Farnell; ComponentLink12Description: https://datasheet.octopart.com:443/CRCW08058K20FKEA-Vishay-datasheet-12532161.pdf?src-supplier=Farnell; ComponentLink13URL: https://datasheet.octopart.com:443/CRCW08058K20FKEA-Vishay-datasheet-12517896.pdf?src-supplier=Farnell; ComponentLink13Description: https://datasheet.octopart.com:443/CRCW08058K20FKEA-Vishay-datasheet-12517896.pdf?src-supplier=Farnell; ComponentLink14URL: https://datasheet.octopart.com:443/CRCW08058K20FKEA-Vishay-datasheet-12509762.pdf?src-supplier=Farnell; ComponentLink14Description: https://datasheet.octopart.com:443/CRCW08058K20FKEA-Vishay-datasheet-12509762.pdf?src-supplier=Farnell; ComponentLink15URL: https://datasheet.octopart.com:443/CRCW08058K20FKEA-Vishay-datasheet-10322335.pdf?src-supplier=Farnell; ComponentLink15Description: https://datasheet.octopart.com:443/CRCW08058K20FKEA-Vishay-datasheet-10322335.pdf?src-supplier=Farnell; ComponentLink16URL: https://datasheet.octopart.com:443/CRCW08058K20FKEA-Vishay-datasheet-8788789.pdf?src-supplier=Farnell; ComponentLink16Description: https://datasheet.octopart.com:443/CRCW08058K20FKEA-Vishay-datasheet-8788789.pdf?src-supplier=Farnell; ComponentLink17URL: https://datasheet.octopart.com:443/CRCW08058K20FKEA-Vishay-datasheet-8361388.pdf?src-supplier=Farnell; ComponentLink17Description: https://datasheet.octopart.com:443/CRCW08058K20FKEA-Vishay-datasheet-8361388.pdf?src-supplier=Farnell; ComponentLink18URL: https://datasheet.octopart.com:443/CRCW08058K20FKEA-Vishay-datasheet-546287.pdf?src-supplier=Farnell; ComponentLink18Description: https://datasheet.octopart.com:443/CRCW08058K20FKEA-Vishay-datasheet-546287.pdf?src-supplier=Farnell; ComponentLink19URL: https://datasheet.octopart.com:443/CRCW08058K20FKEA-Vishay-datasheet-11516975.pdf?src-supplier=Newark; ComponentLink19Description: https://datasheet.octopart.com:443/CRCW08058K20FKEA-Vishay-datasheet-11516975.pdf?src-supplier=Newark; ComponentLink20URL: https://datasheet.octopart.com:443/CRCW08058K20FKEA-Vishay-datasheet-41302739.pdf?src-supplier=Newark; ComponentLink20Description: https://datasheet.octopart.com:443/CRCW08058K20FKEA-Vishay-datasheet-41302739.pdf?src-supplier=Newark; ComponentLink21URL: https://datasheet.octopart.com:443/CRCW08058K20FKEA-Vishay-datasheet-33013972.pdf?src-supplier=Newark; ComponentLink21Description: https://datasheet.octopart.com:443/CRCW08058K20FKEA-Vishay-datasheet-33013972.pdf?src-supplier=Newark; ComponentLink22URL: https://datasheet.octopart.com:443/CRCW08058K20FKEA-Vishay-datasheet-5300368.pdf?src-supplier=Future+Electronics; ComponentLink22Description: https://datasheet.octopart.com:443/CRCW08058K20FKEA-Vishay-datasheet-5300368.pdf?src-supplier=Future+Electronics; ComponentLink23URL: https://datasheet.octopart.com:443/CRCW08058K20FKEA-Vishay-datasheet-62316122.pdf?src-supplier=Future+Electronics; ComponentLink23Description: https://datasheet.octopart.com:443/CRCW08058K20FKEA-Vishay-datasheet-62316122.pdf?src-supplier=Future+Electronics; ComponentLink24URL: https://datasheet.octopart.com:443/CRCW08058K20FKEA-Vishay-datasheet-5306405.pdf?src-supplier=RS+(Formerly+Allied+Electronics); ComponentLink24Description: https://datasheet.octopart.com:443/CRCW08058K20FKEA-Vishay-datasheet-5306405.pdf?src-supplier=RS+(Formerly+Allied+Electronics); ComponentLink25URL: https://datasheet.octopart.com:443/CRCW08058K20FKEA-Vishay-Dale-datasheet-47688880.pdf?src-supplier=RS+(Formerly+Allied+Electronics); ComponentLink25Description: https://datasheet.octopart.com:443/CRCW08058K20FKEA-Vishay-Dale-datasheet-47688880.pdf?src-supplier=RS+(Formerly+Allied+Electronics); ComponentLink26URL: https://datasheet.octopart.com:443/CRCW08058K20FKEA-Vishay-datasheet-12001583.pdf?src-supplier=RS+(Formerly+Allied+Electronics); ComponentLink26Description: https://datasheet.octopart.com:443/CRCW08058K20FKEA-Vishay-datasheet-12001583.pdf?src-supplier=RS+(Formerly+Allied+Electronics); ComponentLink27URL: https://datasheet.octopart.com:443/CRCW08058K20FKEA-Vishay-datasheet-190005712.pdf?src-supplier=TME; ComponentLink27Description: https://datasheet.octopart.com:443/CRCW08058K20FKEA-Vishay-datasheet-190005712.pdf?src-supplier=TME; ComponentLink28URL: https://datasheet.octopart.com:443/CRCW08058K20FKEA-Vishay-datasheet-11540273.pdf?src-supplier=Arrow+Electronics; ComponentLink28Description: https://datasheet.octopart.com:443/CRCW08058K20FKEA-Vishay-datasheet-11540273.pdf?src-supplier=Arrow+Electronics; ComponentLink29URL: https://datasheet.octopart.com:443/CRCW08058K20FKEA-Vishay-datasheet-8445837.pdf?src-supplier=element14; ComponentLink29Description: https://datasheet.octopart.com:443/CRCW08058K20FKEA-Vishay-datasheet-8445837.pdf?src-supplier=element14; ComponentLink30URL: http://sigma.octopart.com:80/rohs_statement/Vishay-company-15.pdf?src-supplier=Compliance+Statements; ComponentLink30Description: http://sigma.octopart.com:80/rohs_statement/Vishay-company-15.pdf?src-supplier=Compliance+Statements
R?#7 = FRC0805F6801TS: RES 6.8kΩ ±1% 125mW 0805